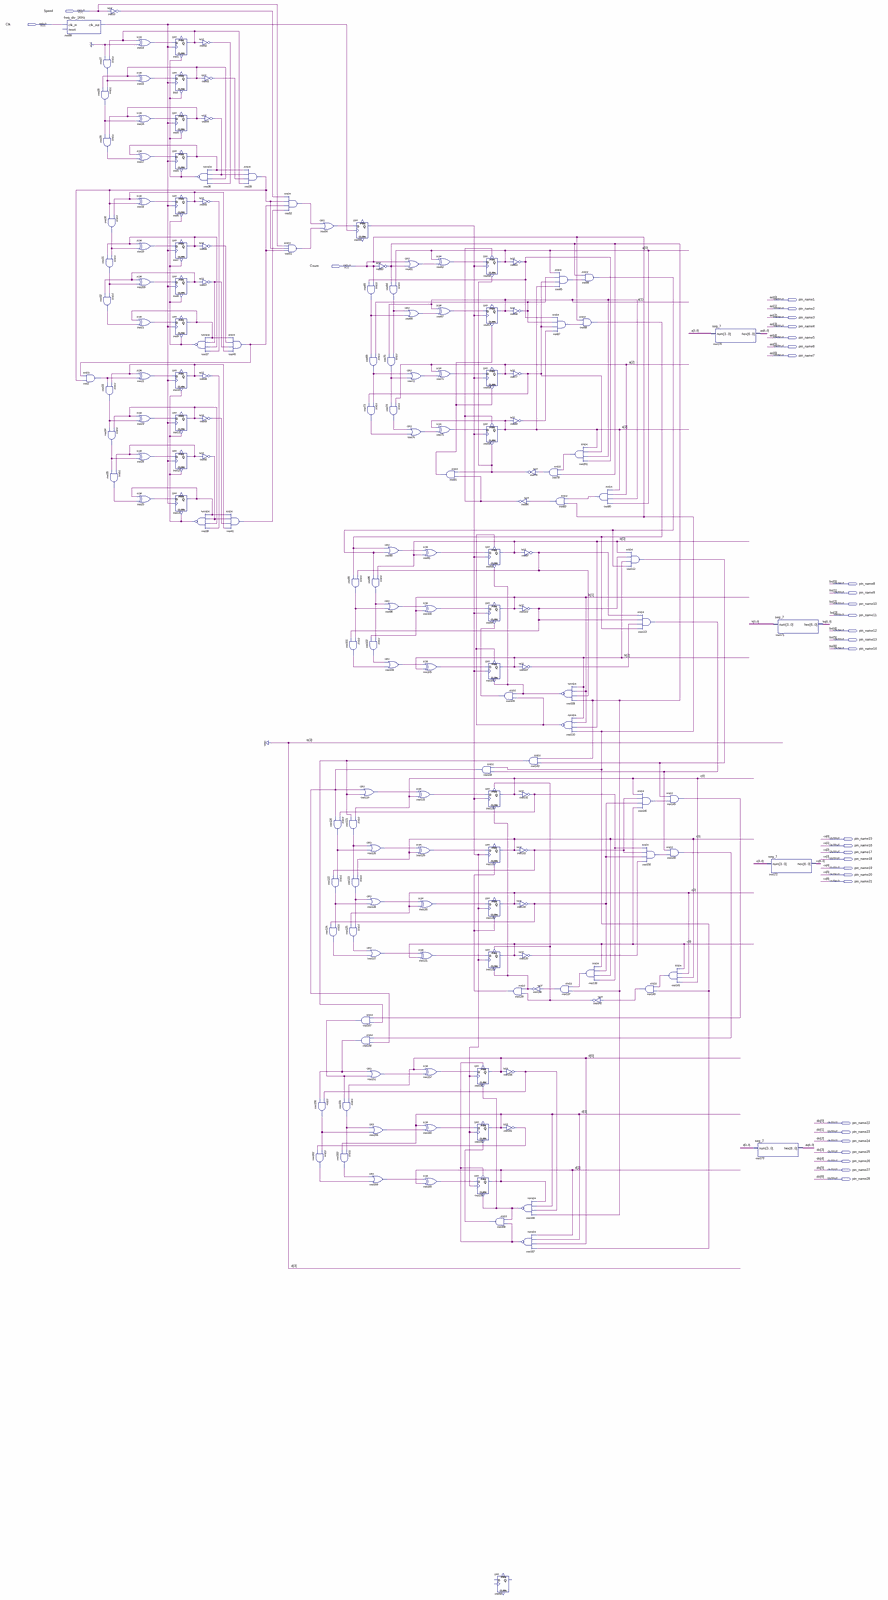
[diagram p0: schematic sheet, whole]
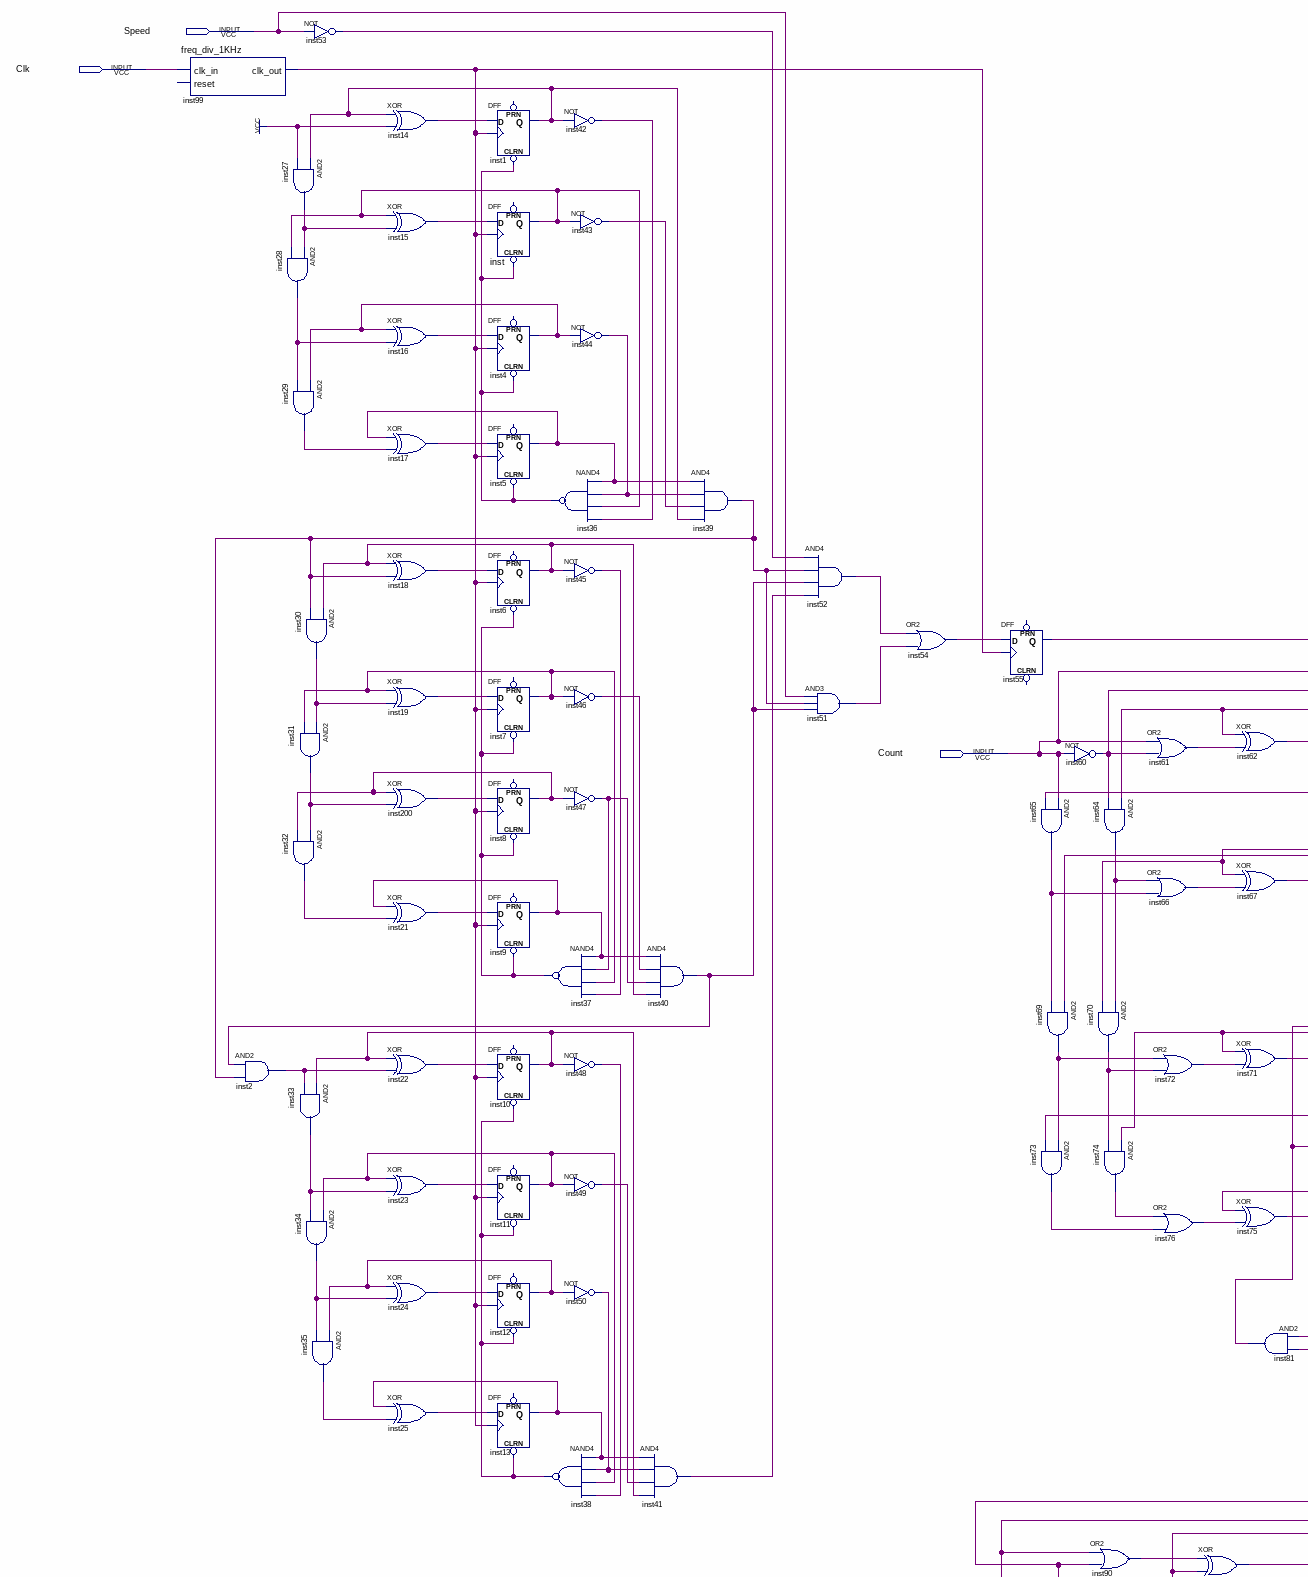
[diagram p1: schematic sheet, upper left part]
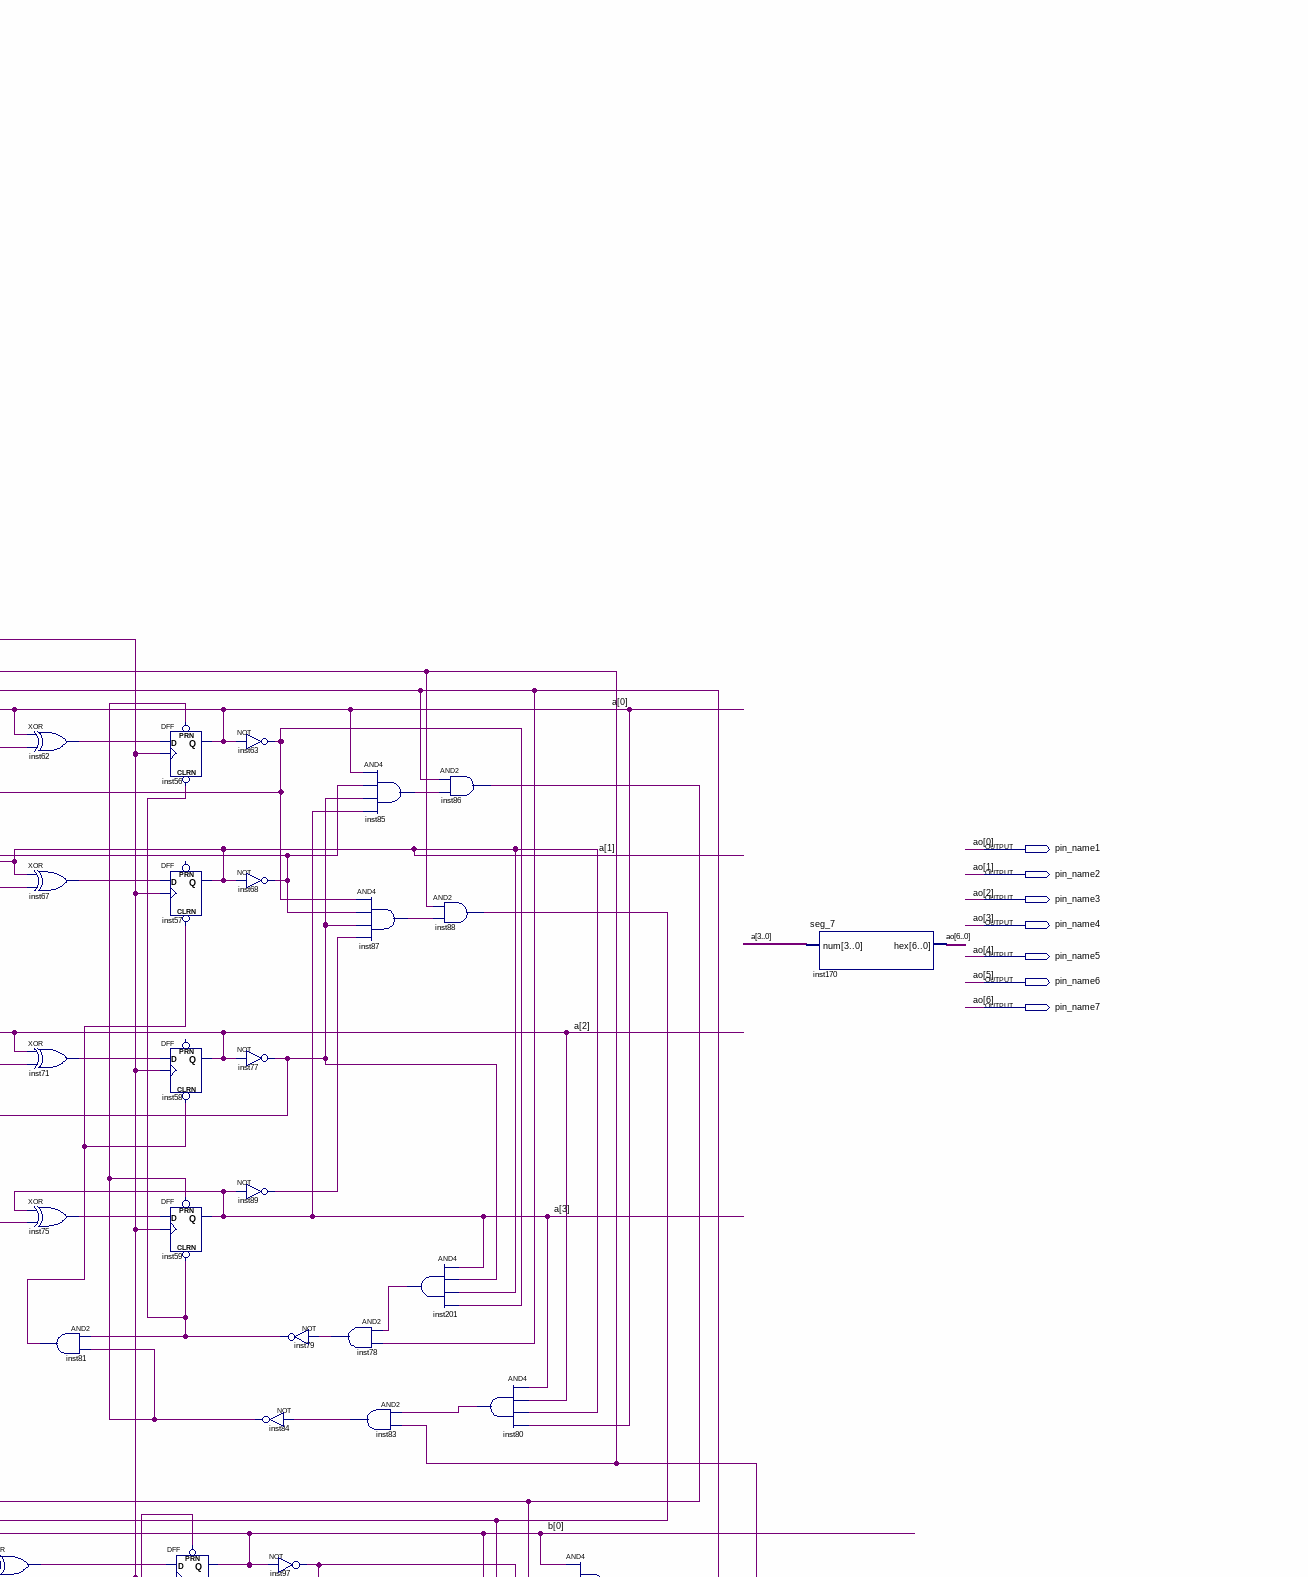
[diagram p2: schematic sheet, upper right part]
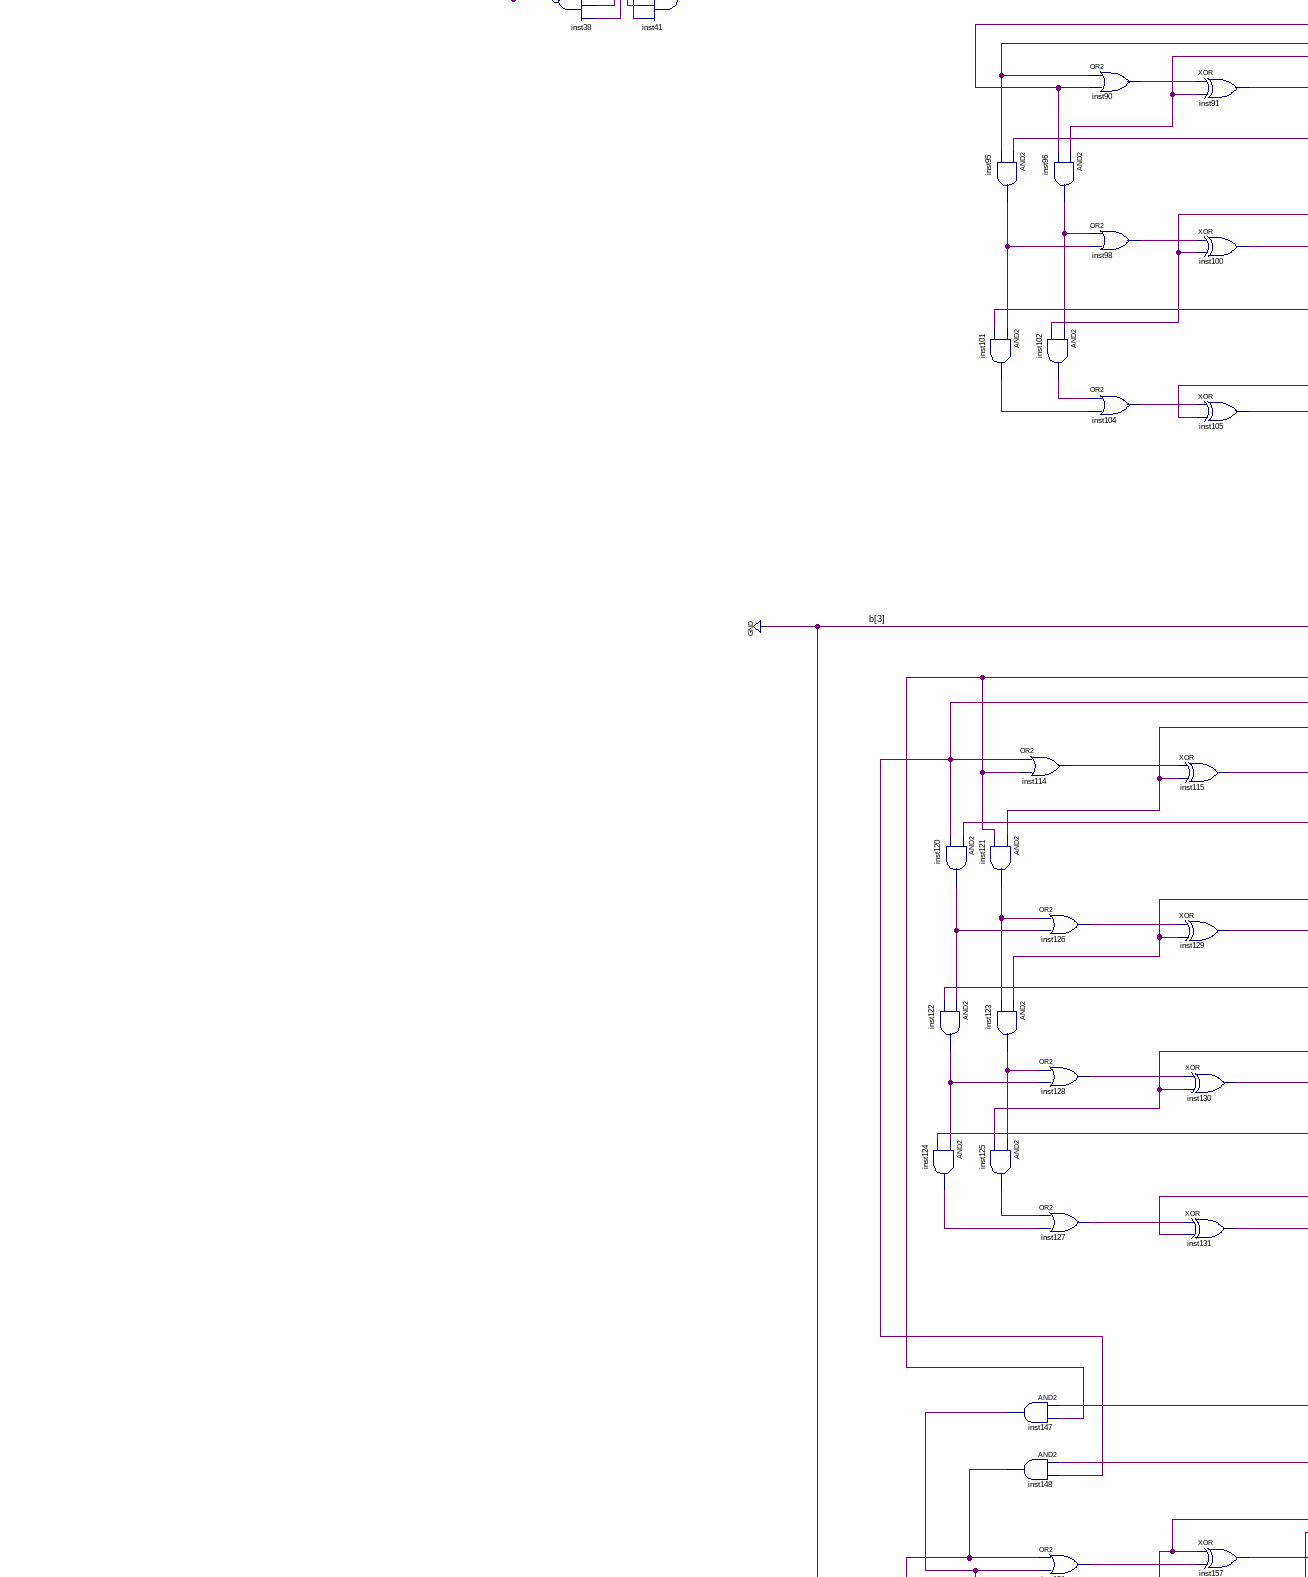
[diagram p3: schematic sheet, middle left part]
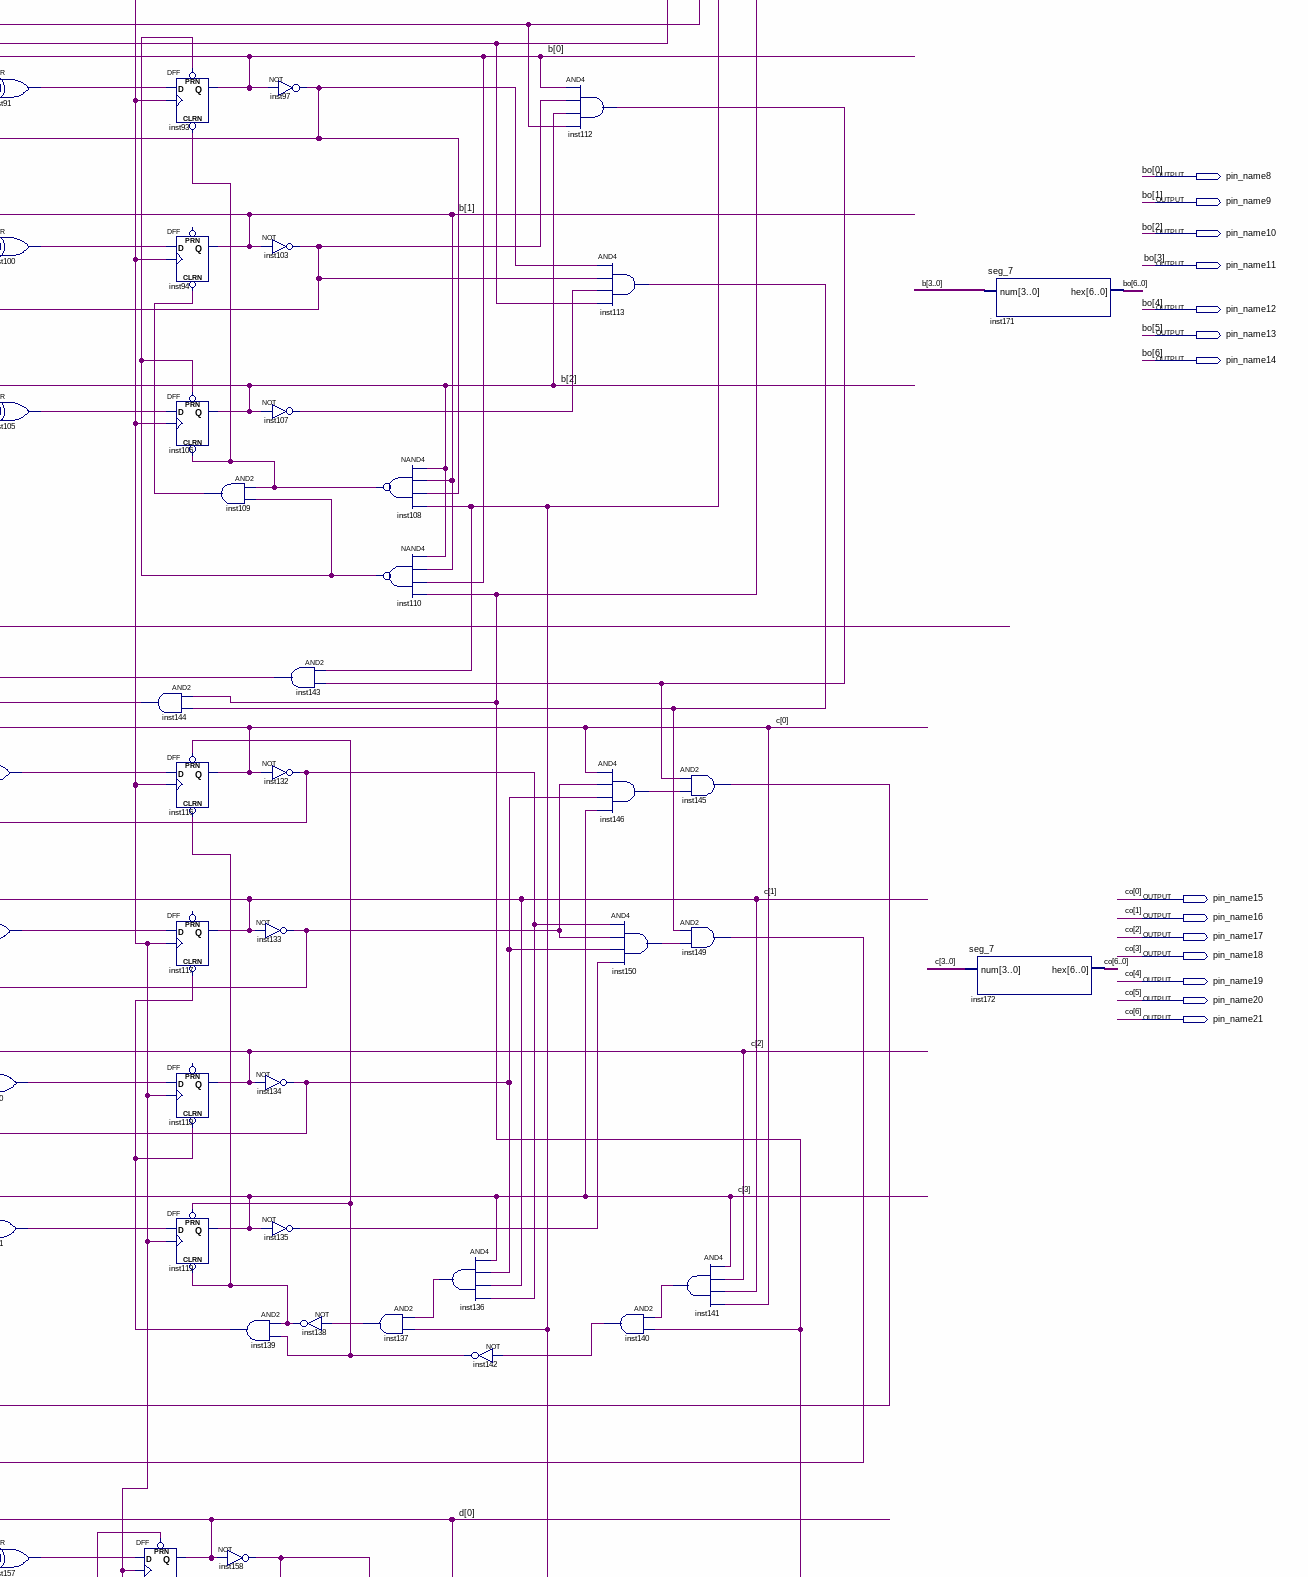
[diagram p4: schematic sheet, middle right part]
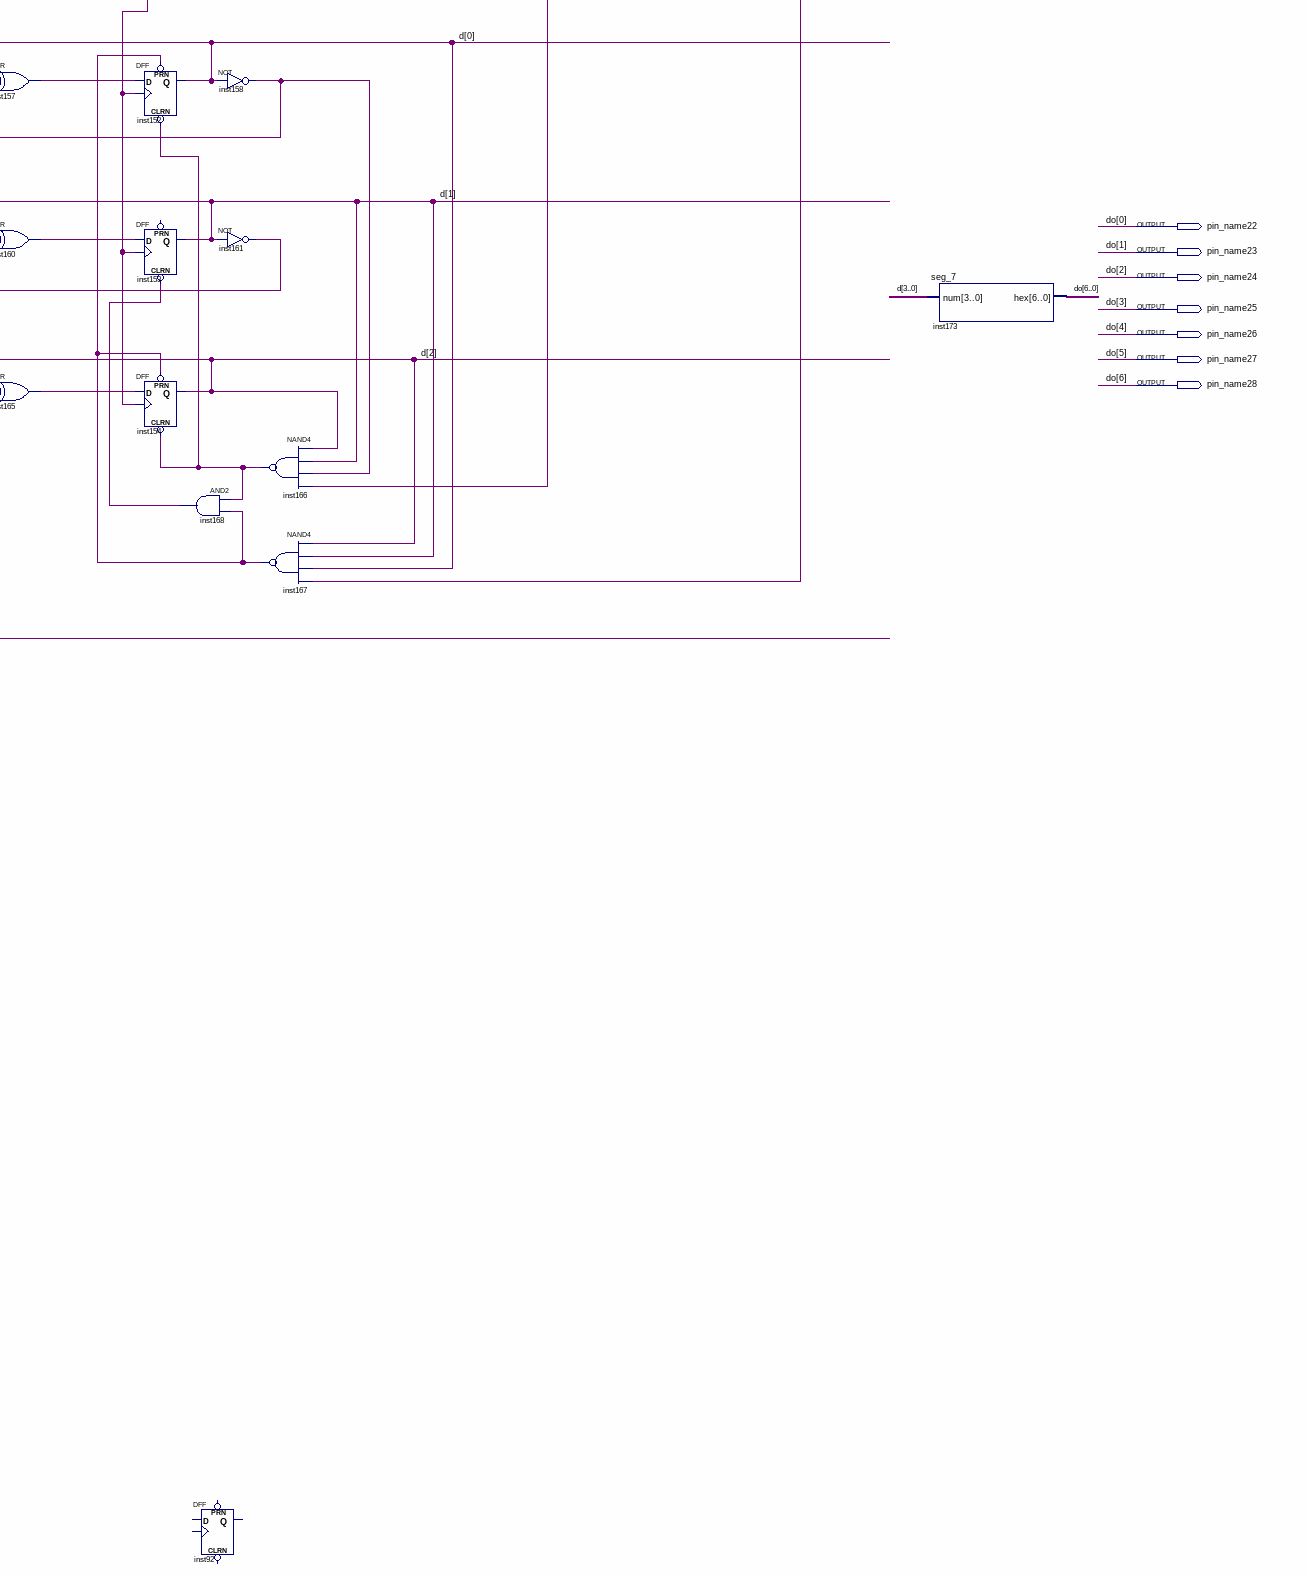
[diagram p5: schematic sheet, lower right part]
// Quartus schematic lab05-2.bdf as structural Verilog: 170 symbols, 31 pins
module \lab05-2  (
  input  Speed,
  input  Clk,
  input  Count,
  output pin_name1,
  output pin_name2,
  output pin_name3,
  output pin_name4,
  output pin_name5,
  output pin_name6,
  output pin_name7,
  output pin_name8,
  output pin_name9,
  output pin_name10,
  output pin_name11,
  output pin_name12,
  output pin_name13,
  output pin_name14,
  output pin_name15,
  output pin_name16,
  output pin_name17,
  output pin_name18,
  output pin_name19,
  output pin_name20,
  output pin_name21,
  output pin_name22,
  output pin_name23,
  output pin_name24,
  output pin_name25,
  output pin_name26,
  output pin_name27,
  output pin_name28
);

  wire inst1_q, inst2_out, inst4_q, inst5_q, inst6_q, inst7_q, inst8_q, inst9_q, inst10_q, inst11_q,
       inst12_q, inst13_q, inst14_out, inst15_out, inst16_out, inst17_out, inst18_out, inst19_out,
       inst21_out, inst22_out, inst23_out, inst24_out, inst25_out, inst27_out, inst28_out, inst29_out,
       inst30_out, inst31_out, inst32_out, inst33_out, inst34_out, inst35_out, inst36_out, inst37_out,
       inst38_out, inst39_out, inst40_out, inst41_out, inst42_out, inst43_out, inst44_out, inst45_out,
       inst46_out, inst47_out, inst48_out, inst49_out, inst50_out, inst51_out, inst52_out, inst53_out,
       inst54_out, inst55_q, inst60_out, inst61_out, inst62_out, inst63_out, inst64_out, inst65_out,
       inst66_out, inst67_out, inst68_out, inst69_out, inst70_out, inst71_out, inst72_out, inst73_out,
       inst74_out, inst75_out, inst76_out, inst77_out, inst78_out, inst79_out, inst80_out, inst81_out,
       inst83_out, inst84_out, inst85_out, inst86_out, inst87_out, inst88_out, inst89_out, inst90_out,
       inst91_out, inst95_out, inst96_out, inst97_out, inst98_out, inst99_clk_out, inst100_out, inst101_out,
       inst102_out, inst103_out, inst104_out, inst105_out, inst107_out, inst108_out, inst109_out,
       inst110_out, inst112_out, inst113_out, inst114_out, inst115_out, inst120_out, inst121_out,
       inst122_out, inst123_out, inst124_out, inst125_out, inst126_out, inst127_out, inst128_out,
       inst129_out, inst130_out, inst131_out, inst132_out, inst133_out, inst134_out, inst135_out,
       inst136_out, inst137_out, inst138_out, inst139_out, inst140_out, inst141_out, inst142_out,
       inst143_out, inst144_out, inst145_out, inst146_out, inst147_out, inst148_out, inst149_out,
       inst150_out, inst151_out, inst155_out, inst156_out, inst157_out, inst158_out, inst159_out,
       inst160_out, inst161_out, inst162_out, inst163_out, inst164_out, inst165_out, inst166_out,
       inst167_out, inst168_out, inst200_out, inst201_out, inst_q;
  wire [2:0] b, d;
  wire [3:0] a, c;

  freq_div_1KHz inst99 (.clk_in(Clk), .clk_out(inst99_clk_out));  // open: reset
  and inst2 (inst2_out, inst40_out, inst39_out);
  and inst27 (inst27_out, inst1_q, 1'b1);
  and inst28 (inst28_out, inst27_out, inst_q);
  and inst29 (inst29_out, inst4_q, inst28_out);
  and inst32 (inst32_out, inst31_out, inst8_q);
  not inst53 (inst53_out, Speed);
  and inst30 (inst30_out, inst6_q, inst39_out);
  and inst31 (inst31_out, inst30_out, inst7_q);
  and inst33 (inst33_out, inst10_q, inst2_out);
  and inst34 (inst34_out, inst11_q, inst33_out);
  and inst35 (inst35_out, inst12_q, inst34_out);
  xor inst14 (inst14_out, inst1_q, 1'b1);
  xor inst15 (inst15_out, inst_q, inst27_out);
  xor inst16 (inst16_out, inst4_q, inst28_out);
  xor inst17 (inst17_out, inst5_q, inst29_out);
  xor inst18 (inst18_out, inst6_q, inst39_out);
  xor inst19 (inst19_out, inst7_q, inst30_out);
  xor inst200 (inst200_out, inst8_q, inst31_out);
  xor inst21 (inst21_out, inst9_q, inst32_out);
  xor inst22 (inst22_out, inst10_q, inst2_out);
  xor inst23 (inst23_out, inst11_q, inst33_out);
  xor inst24 (inst24_out, inst12_q, inst34_out);
  xor inst25 (inst25_out, inst13_q, inst35_out);
  DFF inst1 (.CLRN(inst36_out), .CLK(inst99_clk_out), .D(inst14_out), .Q(inst1_q));  // open: PRN
  DFF inst (.CLRN(inst36_out), .CLK(inst99_clk_out), .D(inst15_out), .Q(inst_q));  // open: PRN
  DFF inst4 (.CLRN(inst36_out), .CLK(inst99_clk_out), .D(inst16_out), .Q(inst4_q));  // open: PRN
  DFF inst5 (.CLRN(inst36_out), .CLK(inst99_clk_out), .D(inst17_out), .Q(inst5_q));  // open: PRN
  DFF inst6 (.CLRN(inst37_out), .CLK(inst99_clk_out), .D(inst18_out), .Q(inst6_q));  // open: PRN
  DFF inst7 (.CLRN(inst37_out), .CLK(inst99_clk_out), .D(inst19_out), .Q(inst7_q));  // open: PRN
  DFF inst8 (.CLRN(inst37_out), .CLK(inst99_clk_out), .D(inst200_out), .Q(inst8_q));  // open: PRN
  DFF inst9 (.CLRN(inst37_out), .CLK(inst99_clk_out), .D(inst21_out), .Q(inst9_q));  // open: PRN
  DFF inst10 (.CLRN(inst38_out), .CLK(inst99_clk_out), .D(inst22_out), .Q(inst10_q));  // open: PRN
  DFF inst11 (.CLRN(inst38_out), .CLK(inst99_clk_out), .D(inst23_out), .Q(inst11_q));  // open: PRN
  DFF inst12 (.CLRN(inst38_out), .CLK(inst99_clk_out), .D(inst24_out), .Q(inst12_q));  // open: PRN
  DFF inst13 (.CLRN(inst38_out), .CLK(inst99_clk_out), .D(inst25_out), .Q(inst13_q));  // open: PRN
  not inst42 (inst42_out, inst1_q);
  not inst43 (inst43_out, inst_q);
  not inst44 (inst44_out, inst4_q);
  nand inst36 (inst36_out, inst5_q, inst44_out, inst_q, inst42_out);
  not inst45 (inst45_out, inst6_q);
  not inst46 (inst46_out, inst7_q);
  not inst47 (inst47_out, inst8_q);
  nand inst37 (inst37_out, inst9_q, inst47_out, inst7_q, inst45_out);
  not inst48 (inst48_out, inst10_q);
  not inst49 (inst49_out, inst11_q);
  not inst50 (inst50_out, inst12_q);
  nand inst38 (inst38_out, inst13_q, inst50_out, inst11_q, inst48_out);
  and inst41 (inst41_out, inst13_q, inst50_out, inst49_out, inst10_q);
  and inst39 (inst39_out, inst5_q, inst44_out, inst43_out, inst1_q);
  and inst40 (inst40_out, inst9_q, inst46_out, inst47_out, inst6_q);
  and inst52 (inst52_out, inst53_out, inst39_out, inst40_out, inst41_out);
  and inst51 (inst51_out, Speed, inst39_out, inst40_out);
  and inst156 (inst156_out, inst158_out, inst148_out);
  and inst162 (inst162_out, inst156_out, inst161_out);
  or inst54 (inst54_out, inst52_out, inst51_out);
  and inst120 (inst120_out, inst132_out, inst144_out);
  and inst122 (inst122_out, inst120_out, inst133_out);
  and inst124 (inst124_out, inst122_out, inst134_out);
  and inst95 (inst95_out, inst97_out, inst88_out);
  and inst101 (inst101_out, inst95_out, inst103_out);
  and inst121 (inst121_out, c[0], inst143_out);
  and inst123 (inst123_out, c[1], inst121_out);
  and inst125 (inst125_out, inst123_out, c[2]);
  and inst155 (inst155_out, d[0], inst147_out);
  and inst163 (inst163_out, inst155_out, d[1]);
  DFF inst55 (.CLK(inst99_clk_out), .D(inst54_out), .Q(inst55_q));  // open: CLRN, PRN
  and inst65 (inst65_out, Count, inst63_out);
  and inst69 (inst69_out, inst68_out, inst65_out);
  and inst73 (inst73_out, inst69_out, inst77_out);
  and inst96 (inst96_out, b[0], inst86_out);
  and inst102 (inst102_out, inst96_out, b[1]);
  or inst114 (inst114_out, inst144_out, inst143_out);
  or inst126 (inst126_out, inst121_out, inst120_out);
  or inst128 (inst128_out, inst123_out, inst122_out);
  or inst127 (inst127_out, inst125_out, inst124_out);
  and inst147 (inst147_out, inst145_out, inst143_out);
  and inst148 (inst148_out, inst149_out, inst144_out);
  or inst151 (inst151_out, inst148_out, inst147_out);
  or inst159 (inst159_out, inst155_out, inst156_out);
  or inst164 (inst164_out, inst163_out, inst162_out);
  not inst60 (inst60_out, Count);
  and inst64 (inst64_out, a[0], inst60_out);
  and inst70 (inst70_out, inst64_out, a[1]);
  and inst74 (inst74_out, a[2], inst70_out);
  or inst90 (inst90_out, inst88_out, inst86_out);
  or inst98 (inst98_out, inst96_out, inst95_out);
  or inst104 (inst104_out, inst102_out, inst101_out);
  or inst61 (inst61_out, Count, inst60_out);
  or inst66 (inst66_out, inst64_out, inst65_out);
  or inst72 (inst72_out, inst69_out, inst70_out);
  or inst76 (inst76_out, inst74_out, inst73_out);
  xor inst91 (inst91_out, inst90_out, b[0]);
  xor inst100 (inst100_out, inst98_out, b[1]);
  xor inst105 (inst105_out, inst104_out, b[2]);
  xor inst115 (inst115_out, inst114_out, c[0]);
  xor inst129 (inst129_out, inst126_out, c[1]);
  xor inst130 (inst130_out, inst128_out, c[2]);
  xor inst131 (inst131_out, inst127_out, c[3]);
  xor inst157 (inst157_out, d[0], inst151_out);
  xor inst160 (inst160_out, d[1], inst159_out);
  xor inst165 (inst165_out, inst164_out, d[2]);
  xor inst62 (inst62_out, a[0], inst61_out);
  xor inst67 (inst67_out, a[1], inst66_out);
  xor inst71 (inst71_out, a[2], inst72_out);
  xor inst75 (inst75_out, a[3], inst76_out);
  and inst81 (inst81_out, inst79_out, inst84_out);
  and inst144 (inst144_out, Count, inst113_out);
  DFF inst152 (.CLRN(inst166_out), .CLK(inst55_q), .D(inst157_out), .PRN(inst167_out), .Q(d[0]));
  DFF inst153 (.CLRN(inst168_out), .CLK(inst55_q), .D(inst160_out), .Q(d[1]));  // open: PRN
  DFF inst154 (.CLRN(inst166_out), .CLK(inst55_q), .D(inst165_out), .PRN(inst167_out), .Q(d[2]));
  DFF inst56 (.CLRN(inst79_out), .CLK(inst55_q), .D(inst62_out), .PRN(inst84_out), .Q(a[0]));
  DFF inst57 (.CLRN(inst81_out), .CLK(inst55_q), .D(inst67_out), .Q(a[1]));  // open: PRN
  DFF inst58 (.CLRN(inst81_out), .CLK(inst55_q), .D(inst71_out), .Q(a[2]));  // open: PRN
  DFF inst59 (.CLRN(inst79_out), .CLK(inst55_q), .D(inst75_out), .PRN(inst84_out), .Q(a[3]));
  DFF inst93 (.CLRN(inst108_out), .CLK(inst55_q), .D(inst91_out), .PRN(inst110_out), .Q(b[0]));
  DFF inst94 (.CLRN(inst109_out), .CLK(inst55_q), .D(inst100_out), .Q(b[1]));  // open: PRN
  DFF inst106 (.CLRN(inst108_out), .CLK(inst55_q), .D(inst105_out), .PRN(inst110_out), .Q(b[2]));
  DFF inst116 (.CLRN(inst138_out), .CLK(inst55_q), .D(inst115_out), .PRN(inst142_out), .Q(c[0]));
  DFF inst117 (.CLRN(inst139_out), .CLK(inst55_q), .D(inst129_out), .Q(c[1]));  // open: PRN
  DFF inst118 (.CLRN(inst139_out), .CLK(inst55_q), .D(inst130_out), .Q(c[2]));  // open: PRN
  DFF inst119 (.CLRN(inst138_out), .CLK(inst55_q), .D(inst131_out), .PRN(inst142_out), .Q(c[3]));
  and inst168 (inst168_out, inst166_out, inst167_out);
  DFF inst92 ();  // open: CLRN, CLK, D, PRN, Q
  not inst63 (inst63_out, a[0]);
  not inst68 (inst68_out, a[1]);
  not inst77 (inst77_out, a[2]);
  not inst89 (inst89_out, a[3]);
  and inst109 (inst109_out, inst108_out, inst110_out);
  and inst139 (inst139_out, inst138_out, inst142_out);
  not inst158 (inst158_out, d[0]);
  not inst161 (inst161_out, d[1]);
  not inst79 (inst79_out, inst78_out);
  not inst84 (inst84_out, inst83_out);
  not inst97 (inst97_out, b[0]);
  not inst103 (inst103_out, b[1]);
  not inst107 (inst107_out, b[2]);
  and inst143 (inst143_out, inst60_out, inst112_out);
  not inst132 (inst132_out, c[0]);
  not inst133 (inst133_out, c[1]);
  not inst134 (inst134_out, c[2]);
  not inst135 (inst135_out, c[3]);
  not inst138 (inst138_out, inst137_out);
  nand inst166 (inst166_out, d[2], d[1], inst158_out, inst60_out);
  nand inst167 (inst167_out, d[2], d[1], d[0], Count);
  and inst78 (inst78_out, inst201_out, inst60_out);
  and inst85 (inst85_out, a[0], inst68_out, inst77_out, a[3]);
  and inst87 (inst87_out, inst63_out, inst68_out, inst77_out, inst89_out);
  and inst83 (inst83_out, inst80_out, Count);
  nand inst108 (inst108_out, b[2], b[1], inst97_out, inst60_out);
  nand inst110 (inst110_out, b[2], b[1], b[0], Count);
  and inst137 (inst137_out, inst136_out, inst60_out);
  and inst86 (inst86_out, inst60_out, inst85_out);
  and inst88 (inst88_out, Count, inst87_out);
  and inst201 (inst201_out, a[3], inst77_out, a[1], inst63_out);
  and inst136 (inst136_out, c[3], inst134_out, c[1], inst132_out);
  and inst80 (inst80_out, a[3], a[2], a[1], a[0]);
  not inst142 (inst142_out, inst140_out);
  and inst112 (inst112_out, b[0], inst103_out, b[2], inst86_out);
  and inst113 (inst113_out, inst97_out, inst103_out, inst107_out, inst88_out);
  and inst146 (inst146_out, c[0], inst133_out, inst134_out, c[3]);
  and inst150 (inst150_out, inst132_out, inst133_out, inst134_out, inst135_out);
  and inst140 (inst140_out, inst141_out, Count);
  and inst145 (inst145_out, inst112_out, inst146_out);
  and inst149 (inst149_out, inst113_out, inst150_out);
  and inst141 (inst141_out, c[3], c[2], c[1], c[0]);
  seg_7 inst170 (.num(a), .hex({pin_name7, pin_name6, pin_name5, pin_name4, pin_name3, pin_name2, pin_name1}));
  seg_7 inst173 (
    .num({1'b0, d}),
    .hex({pin_name28, pin_name27, pin_name26, pin_name25, pin_name24, pin_name23, pin_name22}));
  seg_7 inst171 (
    .num({1'b0, b}), .hex({pin_name14, pin_name13, pin_name12, pin_name11, pin_name10, pin_name9, pin_name8}));
  seg_7 inst172 (.num(c), .hex({pin_name21, pin_name20, pin_name19, pin_name18, pin_name17, pin_name16, pin_name15}));

  // Other names for the same wires on the sheet: ao[6:0] = {pin_name7, pin_name6, pin_name5, pin_name4, pin_name3, pin_name2, pin_name1};
  //   bo[6:0] = {pin_name14, pin_name13, pin_name12, pin_name11, pin_name10, pin_name9, pin_name8};
  //   co[6:0] = {pin_name21, pin_name20, pin_name19, pin_name18, pin_name17, pin_name16, pin_name15};
  //   do[6:0] = {pin_name28, pin_name27, pin_name26, pin_name25, pin_name24, pin_name23, pin_name22}
endmodule
